# EAGLE schematic os2 (EAGLE 8.5.1)
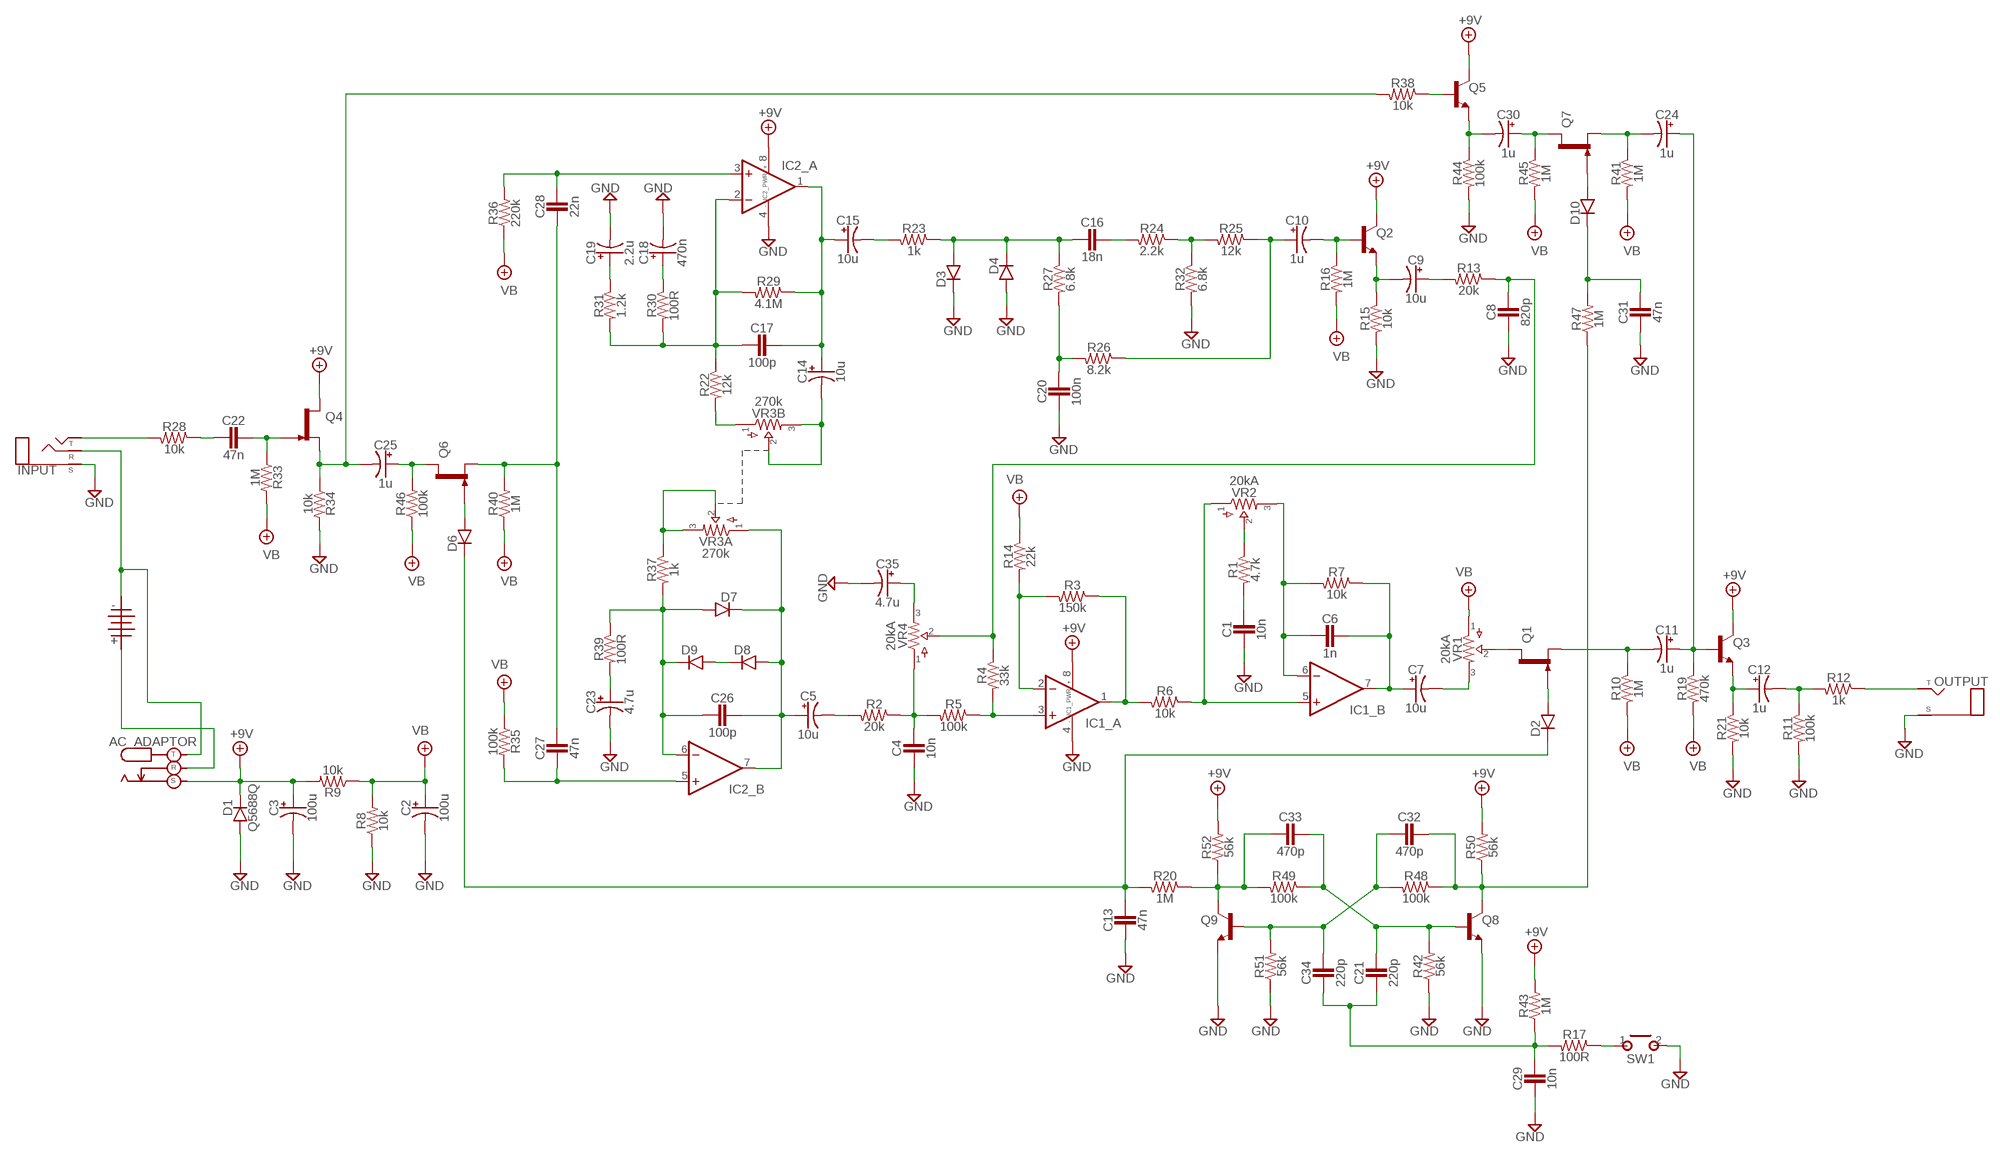
[diagram p0: schematic, sheet 1]

## Parts
1101  BATTERY  [TWO_PADS]
AC_ADAPTOR  DC_KOBICONN  [DC_KOBICONN]
C1  10n  CER/FILMBOX.1  [BOX_SMALL]
C2  100u  0500  [050_020]
C3  100u  0500  [050_020]
C4  10n  CER/FILMBOX.1  [BOX_SMALL]
C5  10u  0500  [050_020]
C6  1n  CER/FILMBOX.1  [BOX_SMALL]
C7  10u  0500  [050_020]
C8  820p  CER/FILMBOX.1  [BOX_SMALL]
C9  10u  0500  [050_020]
C10  1u  0500  [050_020]
C11  1u  0500  [050_020]
C12  1u  0500  [050_020]
C13  47n  CER/FILMBOX.1  [BOX_SMALL]
C14  10u  0500  [050_020]
C15  10u  0500  [050_020]
C16  18n  CER/FILMBOX.1  [BOX_SMALL]
C17  100p  CER/FILMBOX.1  [BOX_SMALL]
C18  470n  0500  [050_020]
C19  2.2u  0500  [050_020]
C20  100n  CER/FILMBOX.1  [BOX_SMALL]
C21  220p  CER/FILMBOX.1  [BOX_SMALL]
C22  47n  CER/FILMBOX.1  [BOX_SMALL]
C23  4.7u  0500  [050_020]
C24  1u  0500  [050_020]
C25  1u  0500  [050_020]
C26  100p  CER/FILMBOX.1  [BOX_SMALL]
C27  47n  CER/FILMBOX.1  [BOX_SMALL]
C28  22n  CER/FILMBOX.1  [BOX_SMALL]
C29  10n  CER/FILMBOX.1  [BOX_SMALL]
C30  1u  0500  [050_020]
C31  47n  CER/FILMBOX.1  [BOX_SMALL]
C32  470p  CER/FILMBOX.1  [BOX_SMALL]
C33  470p  CER/FILMBOX.1  [BOX_SMALL]
C34  220p  CER/FILMBOX.1  [BOX_SMALL]
C35  4.7u  0500  [050_020]
D1  Q5688Q  DO35.2  [DO35-2]
D2  DO35.2  [DO35-2]
D3  DO35.2  [DO35-2]
D4  DO35.2  [DO35-2]
D6  DO35.2  [DO35-2]
D7  DO35.2  [DO35-2]
D8  DO35.2  [DO35-2]
D9  DO35.2  [DO35-2]
D10  DO35.2  [DO35-2]
IC1  DUALTH  [DIL0]
IC2  DUALTH  [DIL0]
INPUT  STEREO3PADS  [THREEPADS]
OUTPUT  MONO  [TWO_PADS]
Q1  2N5457  [TO92-]
Q2  2SC828A  [TO92-]
Q3  2SC828A  [TO92-]
Q4  2N5457  [TO92-]
Q5  2SC828A  [TO92-]
Q6  2N5457  [TO92-]
Q7  2N5457  [TO92-]
Q8  2SC828A  [TO92-]
Q9  2SC828A  [TO92-]
R1  4.7k  R_.3B  [R0207/3]
R2  20k  R_.3B  [R0207/3]
R3  150k  R_.3B  [R0207/3]
R4  33k  R_.3B  [R0207/3]
R5  100k  R_.3B  [R0207/3]
R6  10k  R_.3B  [R0207/3]
R7  10k  R_.3B  [R0207/3]
R8  10k  R_.3B  [R0207/3]
R9  10k  R_.3B  [R0207/3]
R10  1M  R_.3B  [R0207/3]
R11  100k  R_.3B  [R0207/3]
R12  1k  R_.3B  [R0207/3]
R13  20k  R_.3B  [R0207/3]
R14  22k  R_.3B  [R0207/3]
R15  10k  R_.3B  [R0207/3]
R16  1M  R_.3B  [R0207/3]
R17  100R  R_.3B  [R0207/3]
R19  470k  R_.3B  [R0207/3]
R20  1M  R_.3B  [R0207/3]
R21  10k  R_.3B  [R0207/3]
R22  12k  R_.3B  [R0207/3]
R23  1k  R_.3B  [R0207/3]
R24  2.2k  R_.3B  [R0207/3]
R25  12k  R_.3B  [R0207/3]
R26  8.2k  R_.3B  [R0207/3]
R27  6.8k  R_.3B  [R0207/3]
R28  10k  R_.3B  [R0207/3]
R29  4.1M  R_.3B  [R0207/3]
R30  100R  R_.3B  [R0207/3]
R31  1.2k  R_.3B  [R0207/3]
R32  6.8k  R_.3B  [R0207/3]
R33  1M  R_.3B  [R0207/3]
R34  10k  R_.3B  [R0207/3]
R35  100k  R_.3B  [R0207/3]
R36  220k  R_.3B  [R0207/3]
R37  1k  R_.3B  [R0207/3]
R38  10k  R_.3B  [R0207/3]
R39  100R  R_.3B  [R0207/3]
R40  1M  R_.3B  [R0207/3]
R41  1M  R_.3B  [R0207/3]
R42  56k  R_.3B  [R0207/3]
R43  1M  R_.3B  [R0207/3]
R44  100k  R_.3B  [R0207/3]
R45  1M  R_.3B  [R0207/3]
R46  100k  R_.3B  [R0207/3]
R47  1M  R_.3B  [R0207/3]
R48  100k  R_.3B  [R0207/3]
R49  100k  R_.3B  [R0207/3]
R50  56k  R_.3B  [R0207/3]
R51  56k  R_.3B  [R0207/3]
R52  56k  R_.3B  [R0207/3]
SW1  MOMENTARY  [SPST]
VR1  20kA  POTS16MM  [16MM]
VR2  20kA  POTS16MM  [16MM]
VR3A  270k  POTS16MM  [16MM]
VR3B  270k  POTS16MM  [16MM]
VR4  20kA  POTS16MM  [16MM]

## Nets
+9V: AC_ADAPTOR.S C3.+ D1.C IC1.8(_PWR:V+) IC2.8(_PWR:V+) Q2.2(C) Q3.2(C) Q4.3(D) Q5.2(C) R9.2 R43.2 R50.2 R52.2
GND: C1.2 C2.- C3.- C4.2 C8.2 C13.1 C18.- C19.- C20.2 C23.- C29.1 C31.2 C35.- D1.A D3.C D4.A IC1.4(_PWR:V-) IC2.4(_PWR:V-) INPUT.SLEEVE(S) OUTPUT.S(SLEEVE) Q8.3(E) Q9.3(E) R8.1 R11.2 R15.2 R21.2 R32.2 R34.2 R42.1 R44.2 R51.1 SW1.2(S)
N$1: INPUT.TIP(T) R28.2
N$2: 1101.T AC_ADAPTOR.R
N$3: C22.2 R28.1
N$4: C22.1 Q4.1(G) R33.1
N$5: C25.- Q4.2(S) R34.1 R38.2
N$6: C25.+ Q6.3(D) R46.2
N$7: D6.A Q6.1(G)
N$8: C27.1 C28.2 Q6.2(S) R40.2
N$9: C28.1 IC2.3(_A:+IN) R36.2
N$10: C19.+ R31.1
N$11: C14.+ C15.+ C17.1 IC2.1(_A:OUT) R29.1
N$12: R22.2 VR3B.1
N$13: C14.- VR3B.2 VR3B.3
N$14: D8.C D9.A
N$15: R37.1 VR3A.2 VR3A.3
N$16: C26.2 D7.A D9.C IC2.6(_B:-IN) R37.2 R39.1
N$17: C5.+ C26.1 D7.C D8.A IC2.7(_B:OUT) VR3A.1
N$18: C18.+ R30.1
N$19: C17.2 IC2.2(_A:-IN) R22.1 R29.2 R30.2 R31.2
N$20: C27.2 IC2.5(_B:+IN) R35.2
N$21: C15.- R23.2
N$22: C23.+ R39.2
N$23: C16.2 D3.A D4.C R23.1 R27.1
N$24: C20.1 R26.2 R27.2
N$25: C16.1 R24.2
N$26: R24.1 R25.2 R32.1
N$27: C10.+ R25.1 R26.1
N$28: 1101.S AC_ADAPTOR.T INPUT.RING(R)
N$29: C32.2 Q8.2(C) R47.1 R48.1 R50.1
N$30: C10.- Q2.1(B) R16.1
N$31: R17.1 SW1.1(P)
N$32: C21.1 C33.2 Q8.1(B) R42.2 R49.1
N$33: C9.- Q2.3(E) R15.1
N$34: C32.1 C34.1 Q9.1(B) R48.2 R51.2
N$35: C9.+ R13.2
N$36: C8.1 R4.1 R13.1 VR4.2
N$37: C5.- R2.2
N$38: C4.1 R2.1 R5.2 VR4.1
N$39: IC1.3(_A:+IN) R4.2 R5.1
N$40: C35.+ VR4.3
N$41: IC1.2(_A:-IN) R3.2 R14.2
N$42: IC1.1(_A:OUT) R3.1 R6.2
N$43: IC1.5(_B:+IN) R6.1 VR2.1
N$44: C6.2 IC1.6(_B:-IN) R7.2 VR2.3
N$45: R1.1 VR2.2
N$46: C1.1 R1.2
N$47: C6.1 C7.+ IC1.7(_B:OUT) R7.1
N$48: C7.- VR1.3
N$49: Q1.3(D) VR1.2
N$50: C11.- Q1.2(S) R10.1
N$51: D2.A Q1.1(G)
N$52: C11.+ C24.+ Q3.1(B) R19.1
N$53: C12.+ Q3.3(E) R21.1
N$54: OUTPUT.T(TIP) R12.1
N$55: C12.- R11.1 R12.2
N$56: C30.- Q5.3(E) R44.1
N$57: C30.+ Q7.3(D) R45.1
N$58: D10.A Q7.1(G)
N$59: C24.- Q7.2(S) R41.1
N$60: Q5.1(B) R38.1
N$61: C31.1 D10.C R47.2
N$62: C13.2 D2.C D6.C R20.2
N$63: C33.1 Q9.2(C) R20.1 R49.2 R52.1
N$71: C21.2 C29.2 C34.2 R17.2 R43.1
VB: C2.+ R8.2 R9.1 R10.2 R14.1 R16.2 R19.2 R33.2 R35.1 R36.1 R40.1 R41.2 R45.2 R46.1 VR1.1

## Library data of the parts
1101 = pedals-jacks:BATTERY
AC_ADAPTOR = pedals-jacks:DC_KOBICONN
C1 C4 C6 C8 C13 C16 C17 C20-C22 C26-C29 C31-C34 = pedals-capacitors-film:CER/FILM: 47 - 120pF Xicon Ceramic Disc 2.5mm lead spacing
C2 C3 C5 C7 C9-C12 C14 C15 C18 C19 C23-C25 C30 C35 = pedals-capacitors-elec:050
D1-D4 D6-D10 = pedals-diodes:DO35: DO-35 Package Diodes: 1N914
IC1 IC2 = pedals-integrated circuits:DUAL: OP AMP
INPUT = pedals-jacks:STEREO
OUTPUT = pedals-jacks:MONO: Mono 1/4" Phone Jack
Q1 Q4 Q6 Q7 = pedals-transistors:2N5457: N-CHANNEL JFET
Q2 Q3 Q5 Q8 Q9 = pedals-transistors:2SC828A
R1-R17 R19-R52 = pedals-resistors:R_
SW1 = pedals-switches:MOMENTARY
VR1 VR2 VR3A VR3B VR4 = pedals-potentiometers:POTS